# Altium schematic sheet 4_Connectors.schdoc
size 307 x 218 mm; Symbol: Artery_A4; Device: Artery_A4; @Project Name: AT-START-F422/F426; @Page Count: 4; @Create Date: 2025-04-14; Company: Artery Technology; Drawed: SD; Version: 1.0; Page Size: A4; @Update Date: 2025-04-14; @Page No: 4; @Schematic Name: AT-START-F426-V1.0; @Page Name: Connectors; Title Block Position: 3; Width: 1170; Height: 825; Region Start: 1; X Region Count: 6; Y Region Count: 4; Blade Width: 10; @Board Name: AT-START-F426-V1.0; @Create Time: 11:42:27; @Update Time: 14:57:24
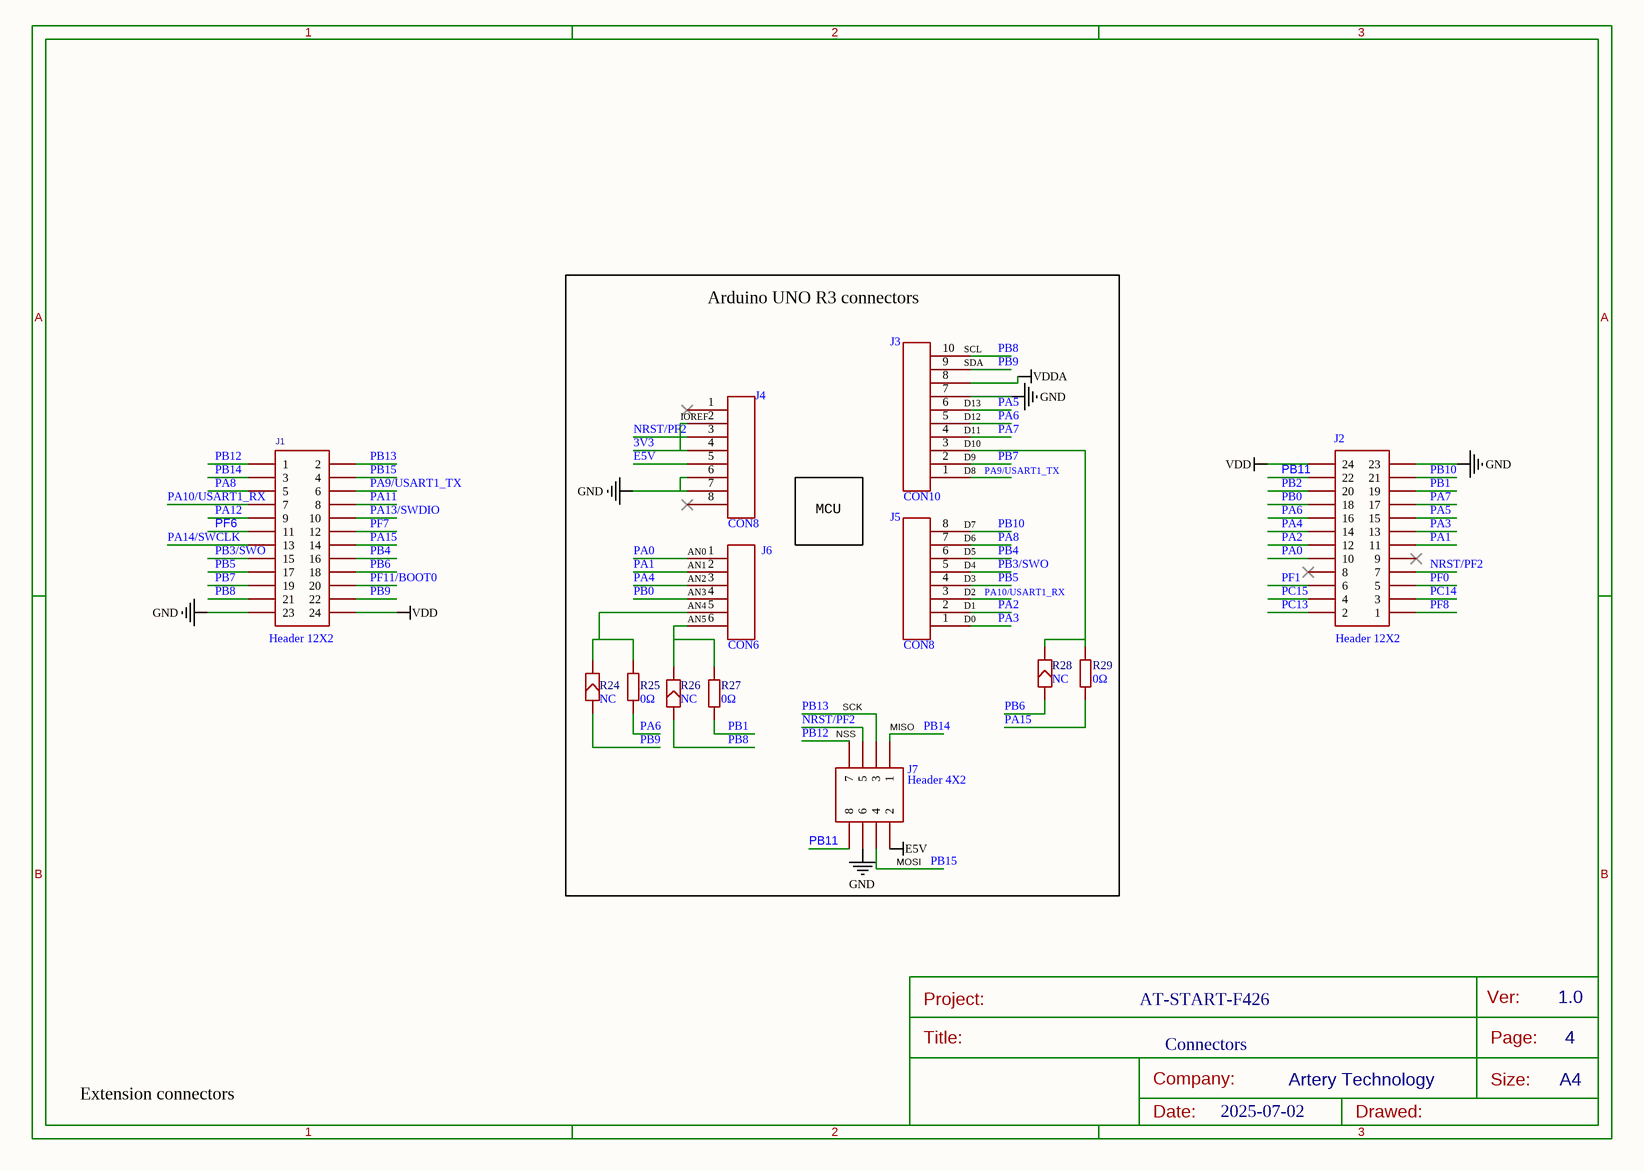
[diagram p0: 4_Connectors.schdoc]

## Parts
J1  Header 12X2  [HEAD2*12]
J2  Header 12X2  [HEAD2*12]
J3  CON10  [HDR1X10 - 2#]
J4  CON8  [HDR1X8 - 2#]
J5  CON8  [HDR1X8 - 2#]
J6  CON6  [HDR1X6 -2#]
J7  Header 4X2  [HDR2X4]
R24  NC  [SB-PAD_2]
R25  0Ω  [SB-PAD_2]
R26  NC  [SB-PAD_2]
R27  0Ω  [SB-PAD_2]
R28  NC  [SB-PAD_2]
R29  0Ω  [SB-PAD_2]

## Blocks framed on the sheet
Arduino UNO R3 connectors: J3-J7 R24-R29

## Nets
E5V: J4.5 J7.2
GND: J1.23 J2.23 J3.7 J4.6 J4.7 J7.6
VDD: J1.24 J2.24
VDDA: J3.8
3V3: J4.2 J4.4
NRST/PF2: J2.7 J4.3 J7.5
PA0: J2.10 J6.1
PA1: J2.11 J6.2
PA2: J2.12 J5.2
PA3: J2.13 J5.1
PA4: J2.14 J6.3
PA5: J2.15 J3.6
PA6: J2.16 J3.5 R25.1
PA7: J2.17 J3.4
PA8: J1.5 J5.7
PA9/USART1_TX: J1.6 J3.1
PA10/USART1_RX: J1.7 J5.3
PA11: J1.8
PA12: J1.9
PA13/SWDIO: J1.10
PA14/SWCLK: J1.13
PA15: J1.14 R29.1
PB0: J2.18 J6.4
PB1: J2.19 R27.1
PB2: J2.20
PB3/SWO: J1.15 J5.5
PB4: J1.16 J5.6
PB5: J1.17 J5.4
PB6: J1.18 R28.1
PB7: J1.19 J3.2
PB8: J1.21 J3.10 R26.1
PB9: J1.22 J3.9 R24.1
PB10: J2.21 J5.8
PB11: J2.22 J7.8
PB12: J1.1 J7.7
PB13: J1.2 J7.3
PB14: J1.3 J7.1
PB15: J1.4 J7.4
PC13: J2.2
PC14: J2.3
PC15: J2.4
PF0: J2.5
PF1: J2.6
PF6: J1.11
PF7: J1.12
PF8: J2.1
PF11/BOOT0: J1.20
NetJ3_3: J3.3 R28.2 R29.2
NetJ6_5: J6.5 R24.2 R25.2
NetJ6_6: J6.6 R26.2 R27.2

Not connected (* = marked no-connect by the designer): J2 8* 9*; J4 1* 8*

## Notes on the sheet
- (near J3) SCL
- (near J3) SDA
- (near J4) IOREF
- (near J3) D10
- (near J3) D11
- (near J3) D12
- (near J3) D13
- MCU
- (near J3) D8
- (near J3) D9
- (near J6) AN0
- (near J6) AN1
- (near J6) AN2
- (near J5) D3
- (near J5) D4
- (near J5) D5
- (near J5) D6
- (near J5) D7
- (near J6) AN3
- (near J6) AN4
- (near J6) AN5
- (near J5) D0
- (near J5) D1
- (near J5) D2
- SCK
- (near J7) NSS
- (near J7) MISO
- (near J7) MOSI
- AT-START-F426
- Extension connectors
- 2025-07-02
- 1
- 2
- 3
- A
- B
- Title:
- Project:
- Connectors
- Page:
- Ver:
- 4
- 1.0
- Date:
- Company:
- Drawed:
- Artery Technology
- Size:
- A4

## Library data of the parts
J1 J2 = Header 12X2: Add into BOM: yes; Symbol: Header 12X2; Device: Header 12X2; LatestRevisionDate: 17-Jul-2002; LatestRevisionNote: Re-released for DXP Platform.; Publisher: Altium Limited; Convert to PCB: yes; Origin Footprint: HEAD2*12; Design Item ID: Header 12X2; Library Name: Miscellaneous Connectors
J3 = CON10: Symbol: CON10_0; Add into BOM: yes; Device: CON10; Convert to PCB: yes; Origin Footprint: HDR1X10 - 2#; Design Item ID: CON10_0; Library Name: *
J4 J5 = CON8: Add into BOM: yes; Symbol: CON8; Device: CON8; Convert to PCB: yes; Origin Footprint: HDR1X8 - 2#; Design Item ID: CON8; Library Name: *
J6 = CON6: Add into BOM: yes; Symbol: CON6; Device: CON6; Convert to PCB: yes; Origin Footprint: HDR1X6 -2#; Design Item ID: CON6; Library Name: *
J7 = Header 4X2: Add into BOM: yes; Symbol: Header 4X2; Device: Header 4X2; LatestRevisionDate: 17-Jul-2002; LatestRevisionNote: Re-released for DXP Platform.; Publisher: Altium Limited; Convert to PCB: yes; Origin Footprint: HDR2X4; Design Item ID: Header 4X2; Library Name: Miscellaneous Connectors
R24 R26 R28 = SB_PAD: Symbol: SB-PAD; Convert to PCB: yes; Device: SB_PAD; Add into BOM: yes; Origin Footprint: SB-PAD; Design Item ID: 10K,1/10W,1%,SMD0603_Dup1; Library Name: *
R25 R27 R29 = 0603WAF0000T5E: Manufacturer: UNI-ROYAL(厚声); Add into BOM: yes; Tolerance: ±1%; Power(Watts): 100mW; Overload Voltage (Max): 75V; Origin Footprint: SB-PAD; Symbol: 0603WAF0000T5E; Device: 0603WAF0000T5E; Supplier: LCSC; Manufacturer Part: 0603WAF0000T5E; Supplier Part: C21189; Value: 0Ω; JLCPCB Part Class: Basic Part; LCSC Part Name: 0Ω ±1% 100mW 厚膜电阻; Supplier Footprint: 0603; Datasheet: https://atta.szlcsc.com/upload/public/pdf/source/20200306/C422600_1E6D84923E4A46A82E41ADD87F860B5C.pdf; Convert to PCB: yes; Type: 厚膜电阻; Operating Temperature Range: -55℃~+155℃; Design Item ID: 10K,1/10W,1%,SMD0603_Dup1; Library Name: *